# Altium project 24TFTSPI240x320.PrjPCB
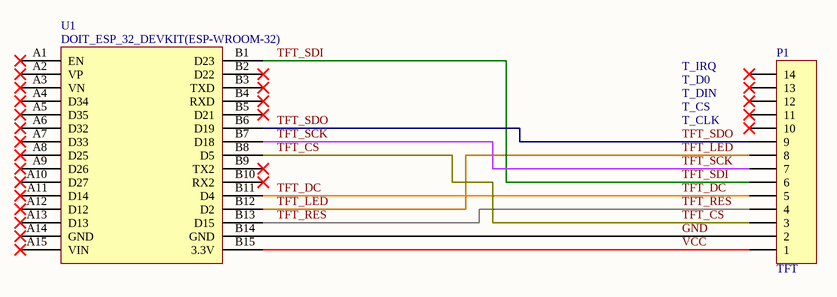
[diagram p0: 24TFTSPI240x320.SchDoc]
1 sheet, 2 parts. Net scope: global (net labels, ports and power ports of the same name join across sheets).

## Sheet 24TFTSPI240x320.SchDoc
size A4; PageSetup: Record=PageOptions|CenterHorizontal=True|CenterVertical=True|PrintScale=1.00|XCorrection=1.00|YCorrection=1.00|PrintKind=0|BorderSize=5000000|LeftOffset=0|BottomOffset=0|Orientation=2|PaperLength=1000|PaperWidth=1000|Scale=100|PaperSource=7|PrintQuality=-3|MediaType=1|DitherType=10|PrintScaleMode=1|PaperKind=A4|PaperIndex=9

### Parts
P1  TFT  [HDR1X14]
U1  DOIT_ESP_32_DEVKIT(ESP-WROOM-32)

### Nets
GND: P1.2 U1.B14(GND)
TFT_CS: P1.3 U1.B8(D5)
TFT_DC: P1.5 U1.B11(D4)
TFT_LED: P1.8 U1.B12(D2)
TFT_RES: P1.4 U1.B13(D15)
TFT_SCK: P1.7 U1.B7(D18)
TFT_SDI: P1.6 U1.B1(D23)
TFT_SDO: P1.9 U1.B6(D19)
VCC: P1.1 U1.B15(3.3V)

Not connected (* = marked no-connect by the designer): P1 10* 11* 12* 13* 14*; U1 A1(EN)* A2(VP)* A3(VN)* A4(D34)* A5(D35)* A6(D32)* A7(D33)* A8(D25)* A9(D26)* A10(D27)* A11(D14)* A12(D12)* A13(D13)* A14(GND)* A15(VIN)* B2(D22)* B3(TXD)* B4(RXD)* B5(D21)* B9(TX2)* B10(RX2)*

### Notes on the sheet
- T_IRQ
- T_CLK
- T_CS
- T_DIN
- T_D0

### Library data of the parts
P1 = Header 14: Header, 14-Pin; LatestRevisionDate: 17-Jul-2002; LatestRevisionNote: Re-released for DXP Platform.; Publisher: Altium Limited
U1 = DOIT_ESP_32_DEVKIT